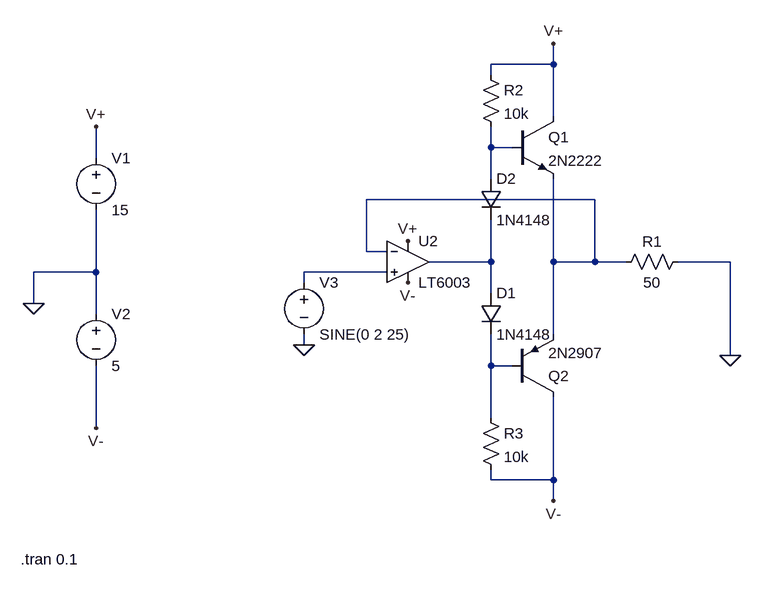
[diagram p0: schematic push-pull.asc]
push-pull.asc, the LTspice schematic file:
Version 4
SHEET 1 880 700
WIRE 272 -80 272 -112
WIRE 272 -80 176 -80
WIRE 176 -64 176 -80
WIRE 272 0 272 -80
WIRE 176 48 176 16
WIRE 208 48 176 48
WIRE -432 64 -432 16
WIRE 176 96 176 48
WIRE 336 128 -16 128
WIRE -16 208 -16 128
WIRE 16 208 -16 208
WIRE 176 224 176 160
WIRE 176 224 80 224
WIRE 272 224 272 96
WIRE 336 224 336 128
WIRE 336 224 272 224
WIRE 384 224 336 224
WIRE 544 224 464 224
WIRE -432 240 -432 144
WIRE -432 240 -528 240
WIRE 16 240 -112 240
WIRE -112 256 -112 240
WIRE 176 272 176 224
WIRE -528 288 -528 240
WIRE -432 304 -432 240
WIRE 272 336 272 224
WIRE -112 352 -112 336
WIRE 544 368 544 224
WIRE 176 384 176 336
WIRE 208 384 176 384
WIRE 176 464 176 384
WIRE -432 480 -432 384
WIRE 176 560 176 544
WIRE 272 560 272 432
WIRE 272 560 176 560
WIRE 272 592 272 560
FLAG -528 288 0
FLAG -432 16 V+
FLAG 272 -112 V+
FLAG -432 480 V-
FLAG 272 592 V-
FLAG 544 368 0
FLAG 48 256 V-
FLAG 48 192 V+
FLAG -112 352 0
SYMBOL npn 208 0 R0
SYMATTR InstName Q1
SYMATTR Value 2N2222
SYMBOL pnp 208 432 M180
SYMATTR InstName Q2
SYMATTR Value 2N2907
SYMBOL res 480 208 R90
WINDOW 0 0 56 VBottom 2
WINDOW 3 32 56 VTop 2
SYMATTR InstName R1
SYMATTR Value 50
SYMBOL voltage -432 48 R0
WINDOW 123 0 0 Left 0
WINDOW 39 0 0 Left 0
SYMATTR InstName V1
SYMATTR Value 15
SYMBOL voltage -432 288 R0
WINDOW 123 0 0 Left 0
WINDOW 39 0 0 Left 0
SYMATTR InstName V2
SYMATTR Value 5
SYMBOL voltage -112 240 R0
WINDOW 123 0 0 Left 0
WINDOW 39 0 0 Left 0
SYMATTR InstName V3
SYMATTR Value SINE(0 2 25)
SYMBOL Opamps\\LT6003 48 224 R0
SYMATTR InstName U2
SYMBOL diode 160 272 R0
SYMATTR InstName D1
SYMATTR Value 1N4148
SYMBOL diode 160 96 R0
SYMATTR InstName D2
SYMATTR Value 1N4148
SYMBOL res 160 -80 R0
SYMATTR InstName R2
SYMATTR Value 10k
SYMBOL res 160 448 R0
SYMATTR InstName R3
SYMATTR Value 10k
TEXT -548 682 Left 2 !.tran 0.1

The netlist it stands for:
* push-pull.asc
Q1 V+ N001 N002 0 2N2222
Q2 V- N005 N002 0 2N2907
R1 0 N002 50
V1 V+ 0 15
V2 0 V- 5
V3 N004 0 SINE(0 2 25)
* U2: LT6003 (symbol Opamps\LT6003 not available, pins judged from their places): In+=N004 In-=N002 V+=V+ V-=V- OUT=N003
D1 N003 N005 1N4148
D2 N001 N003 1N4148
R2 V+ N001 10k
R3 N005 V- 10k
.model D D
.lib standard.dio
.model NPN NPN
.model PNP PNP
.lib standard.bjt
.tran 0.1
.backanno
.end